# Altium schematic sheet Keyboard_Mechanical.SchDoc: Mechanical Holes
size A4; Organization: Low Self Esteam; Revision: v1.0; SheetNumber: 7; SheetTotal: 8
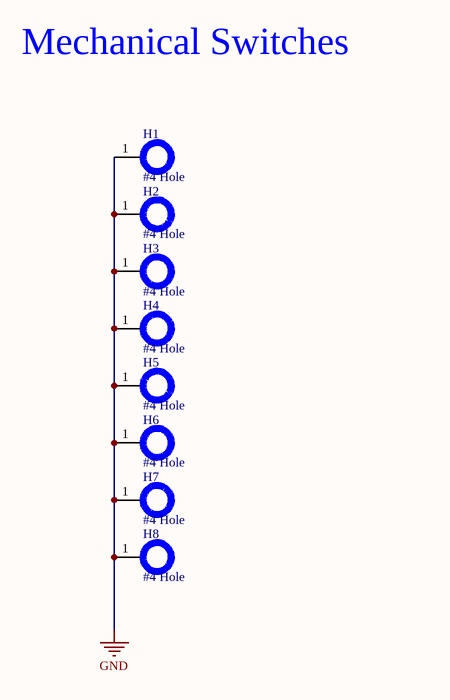
[diagram p0: Keyboard_Mechanical.SchDoc]

## Parts
H1  #4 Hole  [Hole]  (no BOM)
H2  #4 Hole  [Hole]  (no BOM)
H3  #4 Hole  [Hole]  (no BOM)
H4  #4 Hole  [Hole]  (no BOM)
H5  #4 Hole  [Hole]  (no BOM)
H6  #4 Hole  [Hole]  (no BOM)
H7  #4 Hole  [Hole]  (no BOM)
H8  #4 Hole  [Hole]  (no BOM)

## Nets
GND: H1.1 H2.1 H3.1 H4.1 H5.1 H6.1 H7.1 H8.1

## Notes on the sheet
- Mechanical Switches

## Library data of the parts
H1-H8 = HOLE_#4